# Altium schematic sheet Component_from_magic.SchDoc
size A4; SheetNumber: 14; SheetTotal: 14
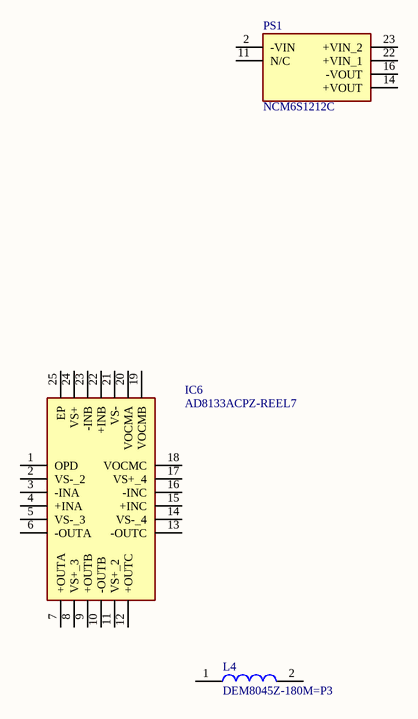
[diagram p0: Component_from_magic.SchDoc]

## Parts
IC6  AD8133ACPZ-REEL7  [QFN50P400X400X100-25N]
L4  DEM8045Z-180M=P3  [1217ASH100MP3]
PS1  NCM6S1212C  [NCM6S1212C]

## Nets

Not connected (* = marked no-connect by the designer): IC6 1(OPD) 2(VS-_2) 3(-INA) 4(+INA) 5(VS-_3) 6(-OUTA) 7(+OUTA) 8(VS+_3) 9(+OUTB) 10(-OUTB) 11(VS+_2) 12(+OUTC) 13(-OUTC) 14(VS-_4) 15(+INC) 16(-INC) 17(VS+_4) 18(VOCMC) 19(VOCMB) 20(VOCMA) 21(VS-) 22(+INB) 23(-INB) 24(VS+) 25(EP); L4 1 2; PS1 2(-VIN) 11(N/C) 14(+VOUT) 16(-VOUT) 22(+VIN_1) 23(+VIN_2)

## Library data of the parts
IC6 = AD8133ACPZ-REEL7: Integrated Circuit; Manufacturer_Name: Analog Devices; Manufacturer_Part_Number: AD8133ACPZ-REEL7; Mouser Part Number: 584-AD8133ACPZ-R7; Mouser Price/Stock: https://www.mouser.co.uk/ProductDetail/Analog-Devices/AD8133ACPZ-REEL7?qs=%2FtpEQrCGXCw%2FNVYI5%2FgCeQ%3D%3D; Arrow Part Number: AD8133ACPZ-REEL7; Arrow Price/Stock: https://www.arrow.com/en/products/ad8133acpz-reel7/analog-devices
L4 = DEM8045Z-180M=P3: Inductor; Manufacturer_Name: Murata Electronics; Datasheet Link: https://psearch.en.murata.com/inductor/product/DEM8045Z-180M%23.html; Height: 4.5mm; Manufacturer_Part_Number: DEM8045Z-180M=P3; Mouser Part Number: 81-DEM8045Z-180M=P3; Mouser Price/Stock: https://www.mouser.co.uk/ProductDetail/Murata-Electronics/DEM8045Z-180M%3dP3?qs=17u8i%2FzlE899jFmFr9F4%252Bg%3D%3D; Arrow Part Number: DEM8045Z-180M=P3; Arrow Price/Stock: https://www.arrow.com/en/products/dem8045z-180mp3/murata-manufacturing
PS1 = NCM6S1212C: Power Supply; Manufacturer_Name: Murata Electronics; Datasheet Link: http://www.mouser.com/datasheet/2/281/kdc_ncm6-775720.pdf; Height: 10.75mm; Manufacturer_Part_Number: NCM6S1212C; Mouser Part Number: 81-NCM6S1212C; Mouser Price/Stock: https://www.mouser.com/Search/Refine.aspx?Keyword=81-NCM6S1212C; Arrow Part Number: NCM6S1212C; Arrow Price/Stock: https://www.arrow.com/en/products/ncm6s1212c/murata-power-solutions